# EAGLE design reload (EAGLE 6.6.0)
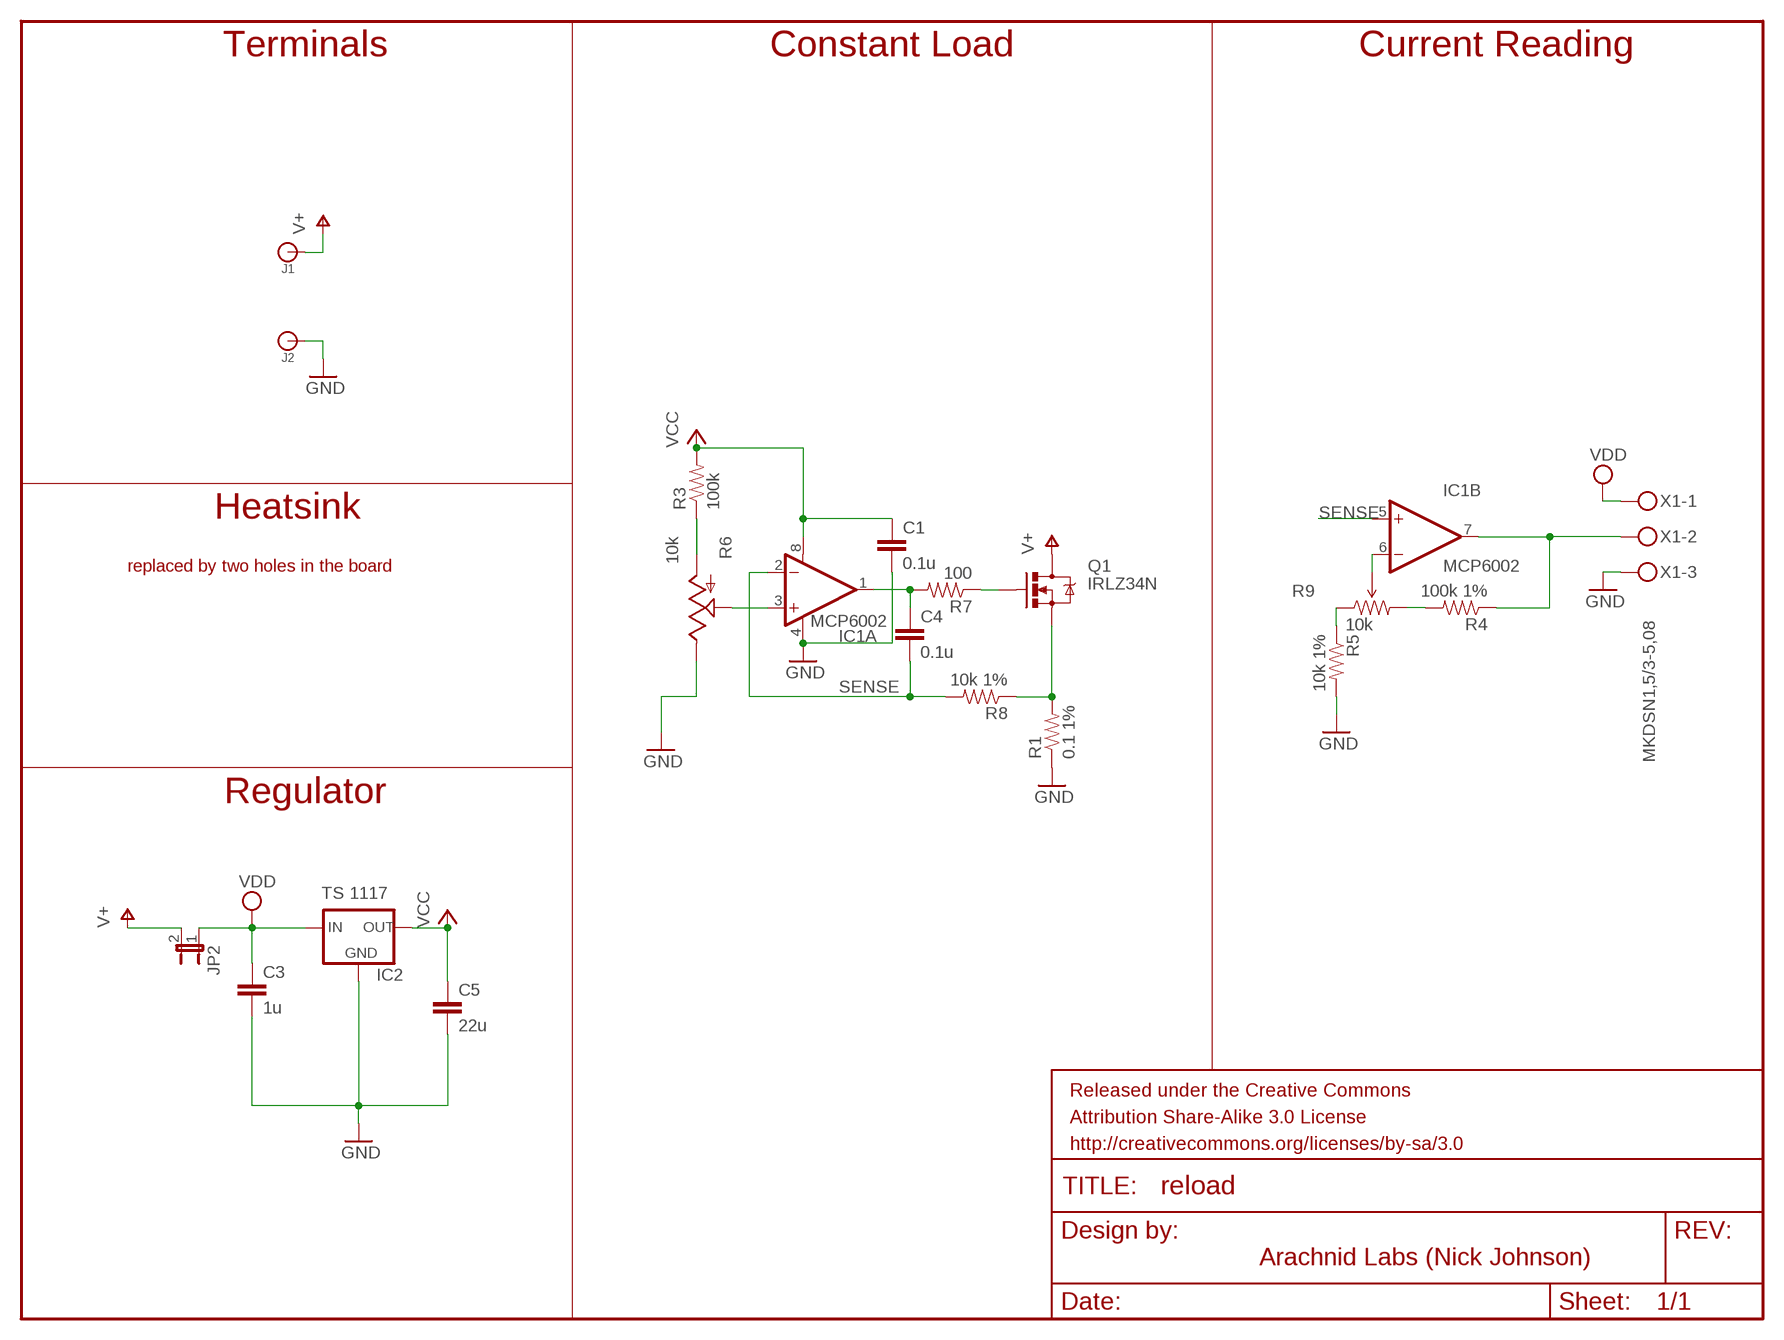
[diagram p0: schematic, sheet 1]

## Parts
C1  0.1u  CAP0805  [0805]
C3  1u  CAP0805  [0805]
C4  0.1u  CAP0805  [0805]
C5  22u  CAP0805  [0805]
IC1  MCP6002  OPAMP-DUALMS  [SOP08]
IC2  TS 1117  V_REG_MIC2920  [SOT223]
J1  BANANA_CONN  [BANANA_CONN]
J2  BANANA_CONN  [BANANA_CONN]
JP2  JUMPER-2PTH  [1X02]
Q1  IRLZ34N  MOSFET-NCHANNELPTH2  [TO220V]
R1  0.1 1%  RESISTOR2512  [R2512]
R3  100k  RESISTOR0805-RES  [0805]
R4  100k 1%  RESISTOR0805-RES  [0805]
R5  10k 1%  RESISTOR0805-RES  [0805]
R6  10k  POT  [ALPS_POT]
R7  100  RESISTOR0805-RES  [0805]
R8  10k 1%  RESISTOR0805-RES  [0805]
R9  10k  TRIMPOTTS53YJ  [TRIMPOT-5MM]
X1  MKDSN1,5/3-5,08  [MKDSN1,5/3-5,08]

## Nets
GND: C1.2 C3.2 C5.2 IC1.4(A:V-) IC2.2(GND) J2.P$1 R1.1 R5.2 R6.P$1(E) X1.3
IREF: IC1.7(B:OUT) R4.1 X1.2
N$1: C4.1 IC1.1(A:OUT) R7.2
N$2: R3.1 R6.P$3(A)
N$3: Q1.3(S) R1.2 R8.1
N$4: IC1.3(A:+IN) R6.P$2(S)
N$5: IC1.6(B:-IN) R9.B(WIPER)
N$6: R5.1 R9.A(CCW)
N$7: R4.2 R9.C(CW)
N$9: Q1.1(G) R7.1
SENSE: C4.2 IC1.2(A:-IN) IC1.5(B:+IN) R8.2
V+: J1.P$1 JP2.2 Q1.2(D)
VCC: C1.1 C5.1 IC1.8(A:V+) IC2.3(OUT) R3.2
VDD: C3.1 IC2.1(IN) JP2.1 X1.1

## Notes on the sheet
- Terminals | Constant Load | Current Reading
- Heatsink
- replaced by two holes in the board
- Regulator
- Arachnid Labs (Nick Johnson)

## Library data of the parts
C1 C3-C5 = SparkFun-Passives:CAP: Capacitor Standard 0603 ceramic capacitor, and 0.1" leaded capacitor.
IC1 = nickparts:OPAMP-DUAL: Generic op-amp footprint
IC2 = SparkFun-PowerIC:V_REG_MIC2920: MIC2920A (http://www.micrel.com/_PDF/mic2920.pdf) - 400mA output LDO Regulator
J1 J2 = SparkFun-Connectors:BANANA_CONN: Through-hole banana jack
JP2 = SparkFun-Passives:JUMPER-2: Jumper Basic 0.1" spaced jumper. Use with breakaway headers.
Q1 = SparkFun-DiscreteSemi:MOSFET-NCHANNEL: Generic NMOS footprint
R1 R3-R5 R7 R8 = SparkFun-Passives:RESISTOR: Resistor Basic schematic elements and footprints for 0603, 1206, and PTH resistors.
R6 = nickparts:POT
R9 = trimmer:TRIMPOT: Various small potentiometers for "set-and-forget" applications
X1 = con-phoenix-508:MKDSN1,5/3-5,08: MKDSN 1,5/ 3-5,08 Printklemme Nennstrom: 13,5 A Nennspannung: 250 V Rastermaß: 5,08 mm Polzahl: 3 Anschlussart: Schraubanschluss Montage: Löten Anschlussrichtung Leiter/Platine: 0 ° Artikelnummer: 1729131 Source: http://eshop.phoenixcontact.com .. 1729131.pdf; MPN: SMKDSN1,5/3-5,08; OC_FARNELL: 1792904; OC_NEWARK: 70R0299

## Board
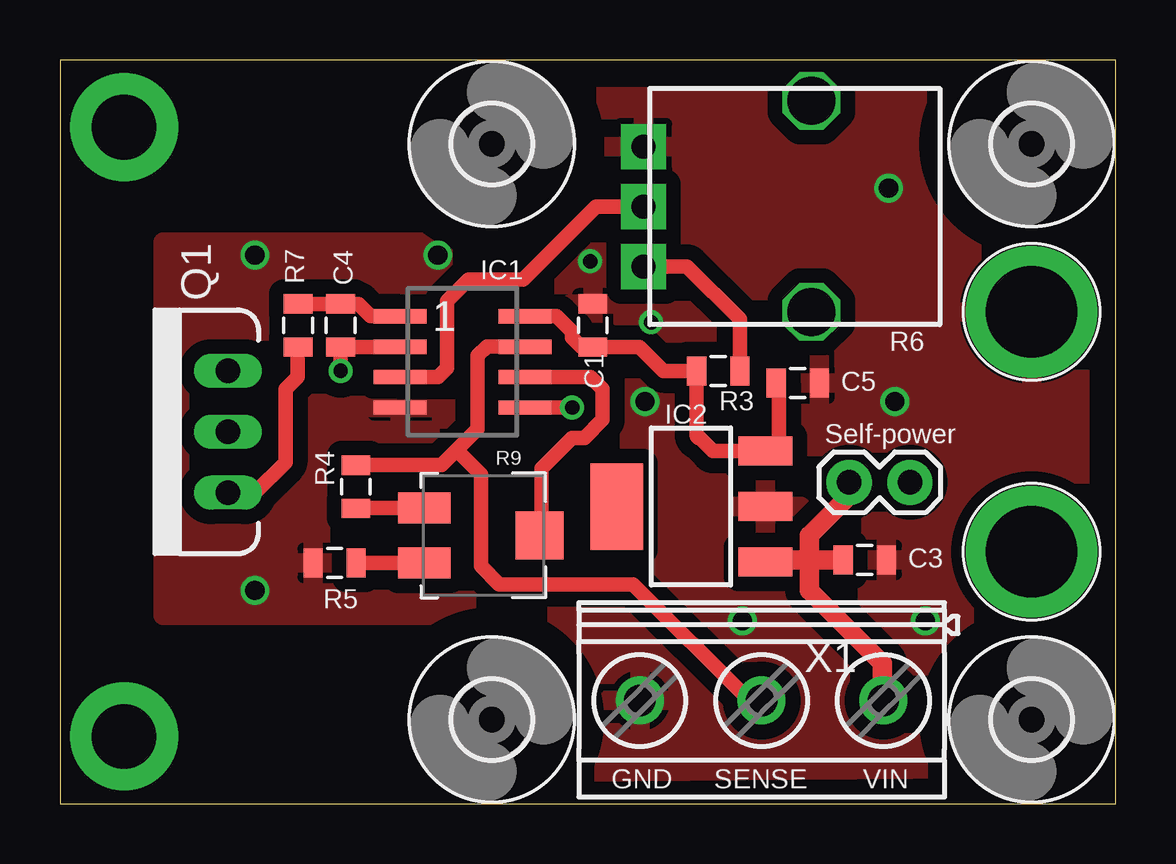
[diagram p1: board, top side]
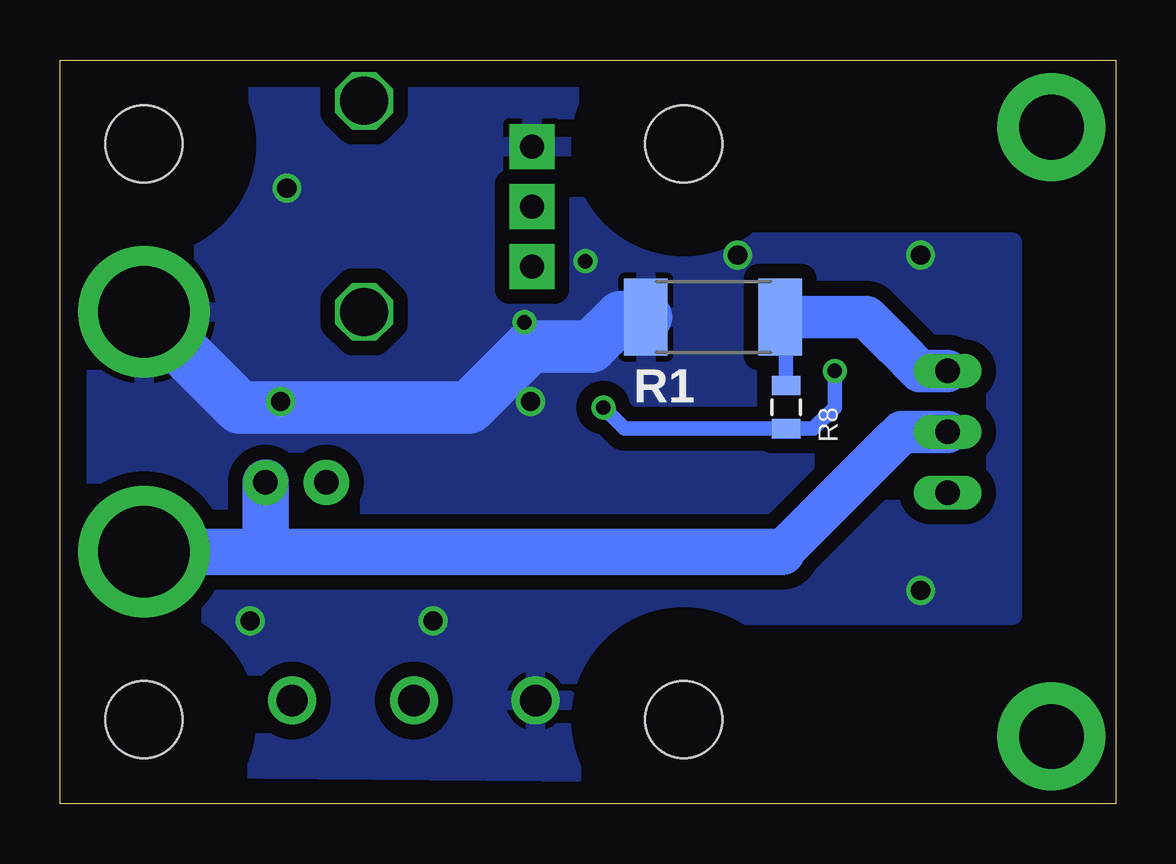
[diagram p2: board, bottom side, seen from below]

Size 44 x 31 mm. Coordinates in mm from the lower left corner, seen from the top.
Outline: 0,0 44,0 44,31 0,31 0,0
Copper layers (1*16): Top 0.035mm / dielectric 1.5mm / Bottom 0.035mm
Design rules "haka_35_l2": minimum track width 0.15mm, minimum drill 0.3mm, track to track 0.15mm, track to pad 0.15mm, pad to pad 0.15mm, via to via 0.15mm, smd to smd 0mil, copper to edge 0.2mm, drill to drill 0.2mm, minimum pad ring 0.2mm, minimum via ring 0.2mm, stop-mask expansion 0.1mm, vias tented up to drill 0mil, thermal gap 10mil

### Footprints (pad centres in the part's own frame; a part is rotated, then mirrored left to right if it is on the bottom)
0805 = smd 0.8 x 1.2: 1 -0.9,0; 2 0.9,0
SOP08 = smd 0.6 x 2.2: 1 -1.905,-2.6; 2 -0.635,-2.6; 3 0.635,-2.6; 4 1.905,-2.6; 5 1.905,2.6; 6 0.635,2.6; 7 -0.635,2.6; 8 -1.905,2.6
SOT223 = smd 1.219 x 2.235: 1 -2.311,-3.099; 2 0,-3.099; 3 2.311,-3.099 | smd 3.6 x 2.2: 4 0,3.099
BANANA_CONN = drill 3.81 pad 5.461: P$1 0,0
1X02 = drill 1.016 pad 1.88: 1 0,0; 2 2.54,0
TO220V = drill 1.016 long: 1 -2.54,0; 2 0,0; 3 2.54,0
R2512 = smd 1.8 x 3.2: 1 -2.8,0; 2 2.8,0
ALPS_POT = drill 1 pad 1.88 square: P$1 7,-2.5; P$2 7,0; P$3 7,2.5 | drill 2 octagon: P$4 0,-4.4; P$5 0,4.4
TRIMPOT-5MM = smd 1.3 x 2.2: A 1.15,-2.1; C -1.15,-2.1 | smd 2 x 2: B 0,2.7
3,2 = hole 3.2: 0,0
MKDSN1,5/3-5,08 = drill 1.3 pad 2: 1 -7.641,0.025; 2 -2.561,0.025; 3 2.519,0.025

### Placement (x,y rotation side)
C1  22.21,19.93 90 top
C3  33.54,10.16 0 top
C4  11.7,19.93 270 top
C5  30.75,17.53 0 top
IC1  16.78,18.41 270 top
IC2  26.3,12.38 90 top
J1  40.5,10.5 0 top
J2  40.5,20.5 0 top
JP2  32.9,13.39 0 top
Q1  7.01,15.5 90 top
R1  16.78,20.29 0 bottom
R3  27.44,18.03 180 top
R4  12.34,13.21 270 top
R5  11.45,10.03 180 top
R6  31.32,24.89 180 top
R7  9.92,19.93 90 top
R8  13.73,16.53 270 bottom
R9  17.29,11.18 270 top
U$1  [3,2]  40.5,27.5 0 top
U$2  [3,2]  40.5,3.5 0 top
U$3  [3,2]  18,3.5 0 top
U$4  [3,2]  18,27.5 0 top
X1  26.69,4.32 180 top

### Tracks (layer width: path | path; a pad name or v marks a point on that pad's centre or on a via)
GND  (via drill 0.6, 0.8)
  Bottom 2.184: R1.1 20.62,20.29 21.86,19.05 24.4,19.05 26.94,16.51 36.51,16.51 J2.P$1
  other vias: 24.64,20.07 24.38,16.76 15.75,22.86 34.8,16.76 8.13,8.89 36.07,7.62 28.45,7.62 22.1,22.61 34.54,25.65 8.13,22.86
  pour Top (isolate 0.61): 4.29,7.85 16.97,7.85 16.97,1.27 42.5,1.5 42.5,29.5 16.97,29.46 16.97,23.4 4.29,23.4
  pour Bottom (isolate 0.61): 4.29,7.85 16.97,7.85 16.97,1.27 42.5,1.5 42.5,29.5 16.97,29.46 16.97,23.4 4.29,23.4
IREF
  Top 0.61: IC1.7 17.8,19.05 17.41,18.67 17.41,15.62 16.53,14.73 | R4.1 15.9,14.11 16.53,14.73 | 16.53,14.73 17.54,13.72 17.54,9.91 18.3,9.14 23.89,9.14 28.74,4.29 X1.2
N$1
  Top 0.61: R7.2 C4.1 12.44,20.83 12.95,20.32 IC1.1
N$2
  Top 0.61: R6.P$3 26.14,22.39 28.34,20.19 R3.1
N$3
  Bottom 0.61: R8.1 13.73,19.78 arc-90 R1.2
  Bottom 1.778: Q1.3 8.15,18.04 9.16,19.05 10.39,20.29 R1.2
N$4
  Top 0.61: IC1.3 15.76,17.78 16.14,18.16 16.14,20.95 17.03,21.84 19.3,21.84 22.35,24.89 R6.P$2
N$5
  Top 0.61: IC1.6 22.11,17.78 22.62,17.27 22.62,16 21.86,15.24 21.35,15.24 20.08,13.97 20.08,11.27 R9.B
N$6
  Top 0.61: R9.A R5.1
N$7
  Top 0.61: R9.C 12.35,12.33 R4.2
N$8  (via drill 2.7 pad 4.5)
  other vias: 2.67,28.19
N$9
  Top 0.61: R7.1 9.91,18.59 9.91,17.78 9.4,17.27 9.4,14.22 8.13,12.96 Q1.1
N$10  (via drill 2.7 pad 4.5)
  other vias: 2.67,2.79
SENSE  (via drill 0.6)
  Top 0.61: v11.7,18.03 C4.2 14.16,19.03 IC1.2 | IC1.5 v21.35,16.51
  Bottom 0.61: v11.7,18.03 11.7,16.51 12.58,15.63 R8.2 20.47,15.63 v21.35,16.51
V+
  Bottom 1.27: 39.71,10.43 39.64,10.5 | 35.44,10.89 35.83,10.5
  Bottom 1.422: 9.16,15.24 8.9,15.5
  Bottom 1.778: 13.9,10.5 9.16,15.24 | 8.9,15.5 Q1.2
  Bottom 1.93: J1.P$1 39.64,10.5 35.83,10.5 13.9,10.5 | JP2.2 35.44,10.89
VCC
  Top 0.61: C5.1 29.97,17.4 29.97,14.73 29.93,14.69 IC2.3 27.22,14.69 26.67,15.24 arc-90 26.54,15.37 R3.2 25.15,18.03 24.15,19.03 C1.1 21.74,19.03 21.34,19.43 21.34,19.68 20.7,20.32 IC1.8
VDD
  Top 0.61: 29.4,10.28 IC2.1
  Top 0.813: X1.1 34.29,4.33 34.29,5.84 31.24,8.89 31.24,10.16 | 31.24,10.16 31.24,11.18 32.9,12.83 JP2.1 | 29.4,10.28 29.52,10.16 31.24,10.16 | C3.1 31.24,10.16

### Text on the board
tNames: Self-power | GND | SENSE | VIN